# EAGLE design schema esp201 (EAGLE 6.5.0)
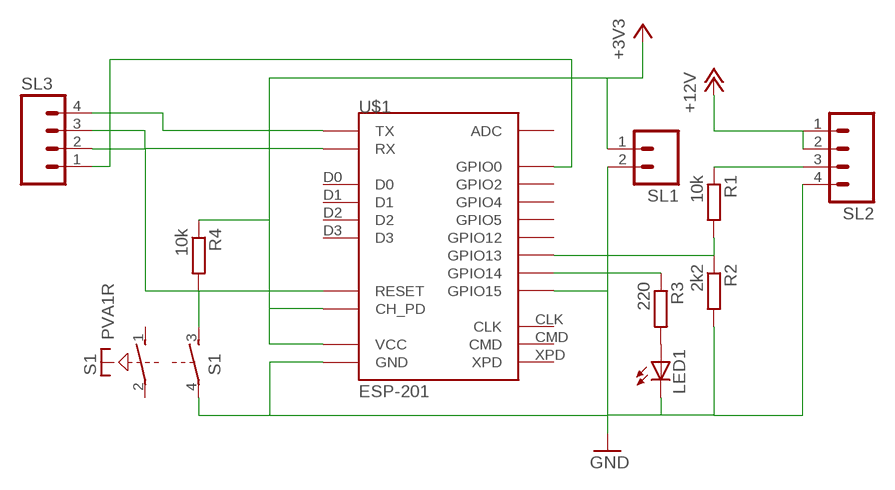
[diagram p0: schematic, sheet 1]

## Parts
LED1  LED3MM  [LED3MM]
R1  10k  R-EU_0207/10  [0207/10]
R2  2k2  R-EU_0207/10  [0207/10]
R3  220  R-EU_0207/10  [0207/10]
R4  10k  R-EU_0207/10  [0207/10]
S1  PVA1R  [PVA1R]
SL1  M02  [02P]
SL2  M04  [04P]
SL3  M04  [04P]
U$1  ESP-201  [ESP-201]

## Nets
+3V3: R4.1 SL1.1 U$1.3V3(VCC) U$1.3V3_2(VCC) U$1.3V3_3(VCC) U$1.CH_PD
+12V: SL2.1 SL2.2
GND: LED1.K(C) R2.2 S1.4(2:P) SL1.2 SL2.4 U$1.GND U$1.GND_2(GND) U$1.GND_3(GND) U$1.GPIO15
N$1: LED1.A R3.2
N$2: R1.2 R2.1 U$1.GPIO13
N$3: R3.1 U$1.GPIO14
N$4: R4.2 S1.3(2:S) SL3.2 U$1.RST(RESET)
N$5: SL3.4 U$1.TX
N$6: SL3.3 U$1.RX
N$7: R1.1 SL2.3
N$8: SL3.1 U$1.GPIO0
Unconnected: S1.1(1:S) S1.2(1:P) U$1.ADC U$1.CLK U$1.CMD U$1.D0 U$1.D1 U$1.D2 U$1.D3 U$1.GPIO2 U$1.GPIO4 U$1.GPIO5 U$1.GPIO12 U$1.XPD

## Library data of the parts
LED1 = led:LED: LED OSRAM: - CHIPLED LG R971, LG N971, LY N971, LG Q971, LY Q971, LO R971, LY R971 LH N974, LH R974 LS Q976, LO Q976, LY Q976 LO Q996 - Hyper CHIPLED LW Q18S LB Q993, LB Q99A, LB R99A - SideLED LS A670, LO A670, LY A670, LG A670, LP A670 LB A673, LV A673, LT A673, LW A673 LH A674 LY A675 LS A676, LA A676, LO A676, LY A676, LW A676 LS A679, LY A679, LG A679 - Hyper Micro SIDELED® LS Y876, LA Y876, LO Y876, LY Y876 LT Y87S - SmartLED LW L88C, LW L88S LB L89C, LB L89S, LG L890 LS L89K, LO L89K, LY L89K LS L896, LA L896, LO L896, LY L896 - TOPLED LS T670, LO T670, LY T670, LG T670, LP T670 LSG T670, LSP T670, LSY T670, LOP T670, LYG T670 LG T671, LOG T671, LSG T671 LB T673, LV T673, LT T673, LW T673 LH T674 LS T676, LA T676, LO T676, LY T676, LB T676, LH T676, LSB T676, LW T676 LB T67C, LV T67C, LT T67C, LS T67K, LO T67K, LY T67K, LW E67C LS E67B, LA E67B, LO E67B, LY E67B, LB E67C, LV E67C, LT E67C LW T67C LS T679, LY T679, LG T679 LS T770, LO T770, LY T770, LG T770, LP T770 LB T773, LV T773, LT T773, LW T773 LH T774 LS E675, LA E675, LY E675, LS T675 LS T776, LA T776, LO T776, LY T776, LB T776 LHGB T686 LT T68C, LB T68C - Hyper Mini TOPLED® LB M676 - Mini TOPLED Santana® LG M470 LS M47K, LO M47K, LY M47K Source: http://www.osram.convergy.de LUXEON: - LUMILED® LXK2-PW12-R00, LXK2-PW12-S00, LXK2-PW14-U00, LXK2-PW14-V00 LXK2-PM12-R00, LXK2-PM12-S00, LXK2-PM14-U00 LXK2-PE12-Q00, LXK2-PE12-R00, LXK2-PE12-S00, LXK2-PE14-T00, LXK2-PE14-U00 LXK2-PB12-K00, LXK2-PB12-L00, LXK2-PB12-M00, LXK2-PB14-N00, LXK2-PB14-P00, LXK2-PB14-Q00 LXK2-PR12-L00, LXK2-PR12-M00, LXK2-PR14-Q00, LXK2-PR14-R00 LXK2-PD12-Q00, LXK2-PD12-R00, LXK2-PD12-S00 LXK2-PH12-R00, LXK2-PH12-S00 LXK2-PL12-P00, LXK2-PL12-Q00, LXK2-PL12-R00 Source: www.luxeon.com KINGBRIGHT: KA-3528ASYC Source: www.kingbright.com
R1-R4 = rcl:R-EU_: RESISTOR, European symbol
S1 = switch-misc:PVA1R: ITT SWITCH
SL1 = con-amp-quick:M02: AMP QUICK CONNECTOR; OC_FARNELL: unknown; OC_NEWARK: unknown
SL2 SL3 = con-amp-quick:M04: AMP QUICK CONNECTOR; OC_FARNELL: unknown; OC_NEWARK: unknown
U$1 = esp8266modules:ESP-201: ESP8266 Wifi Module ESP-201; DIMENSIONS: 25 x 35 mm; PINS: 26; PITCH: 0.1" / 2.54 mm

## Board
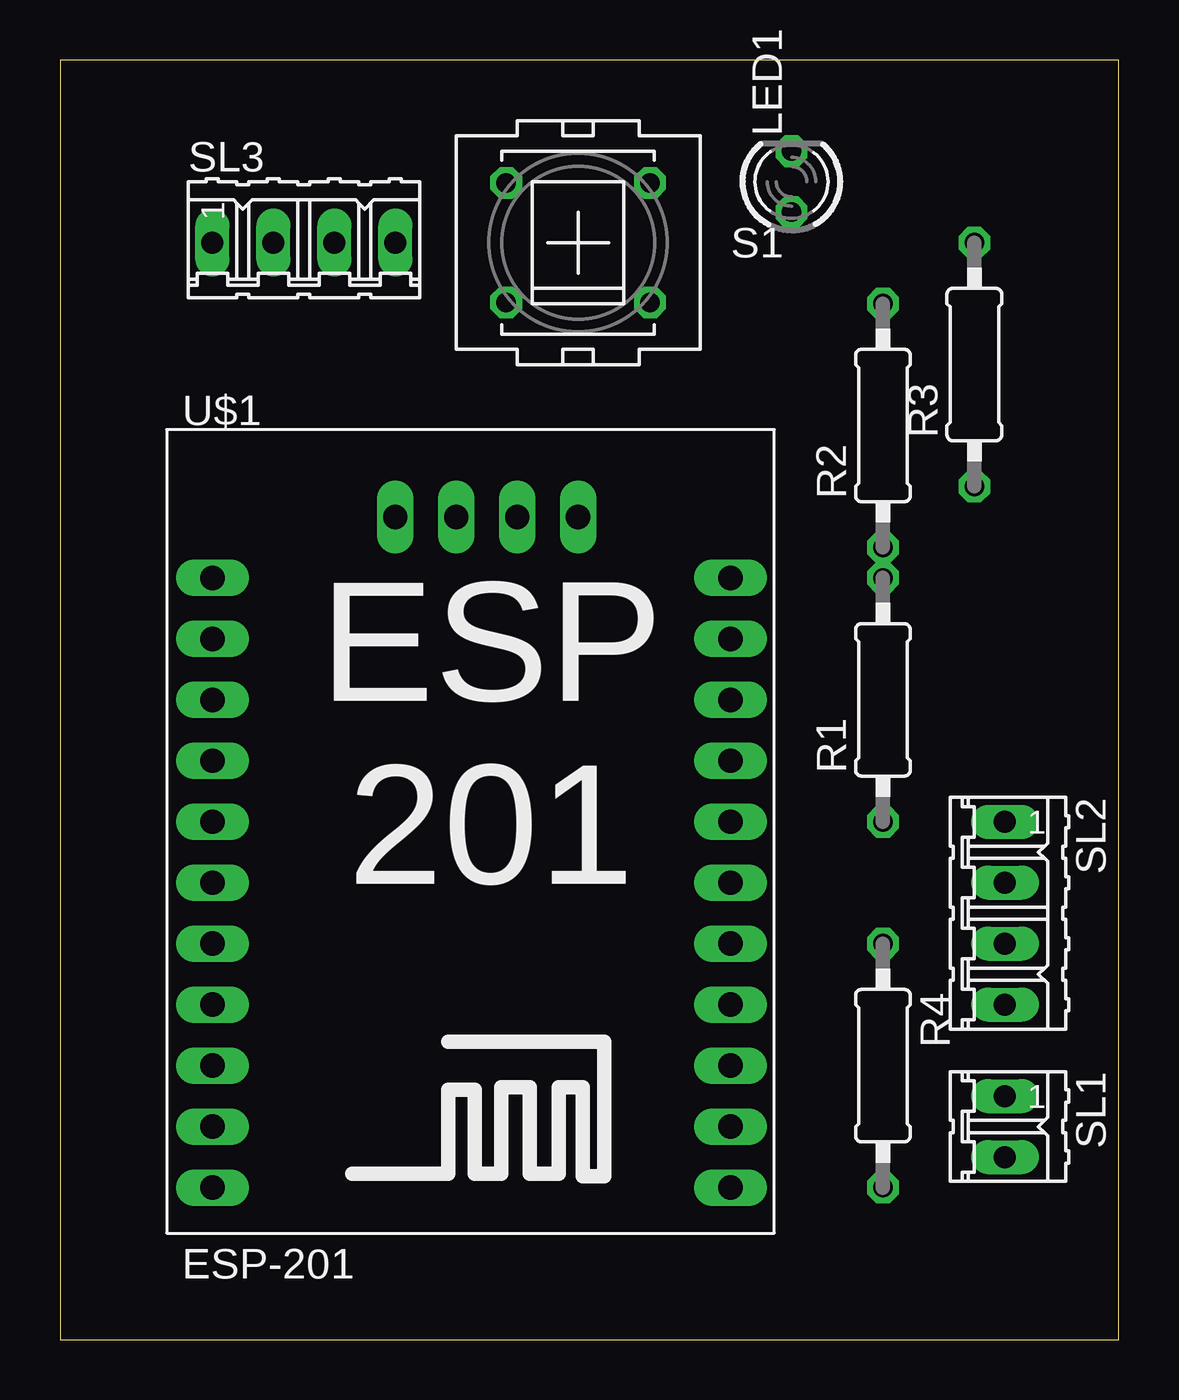
[diagram p1: board, top side]
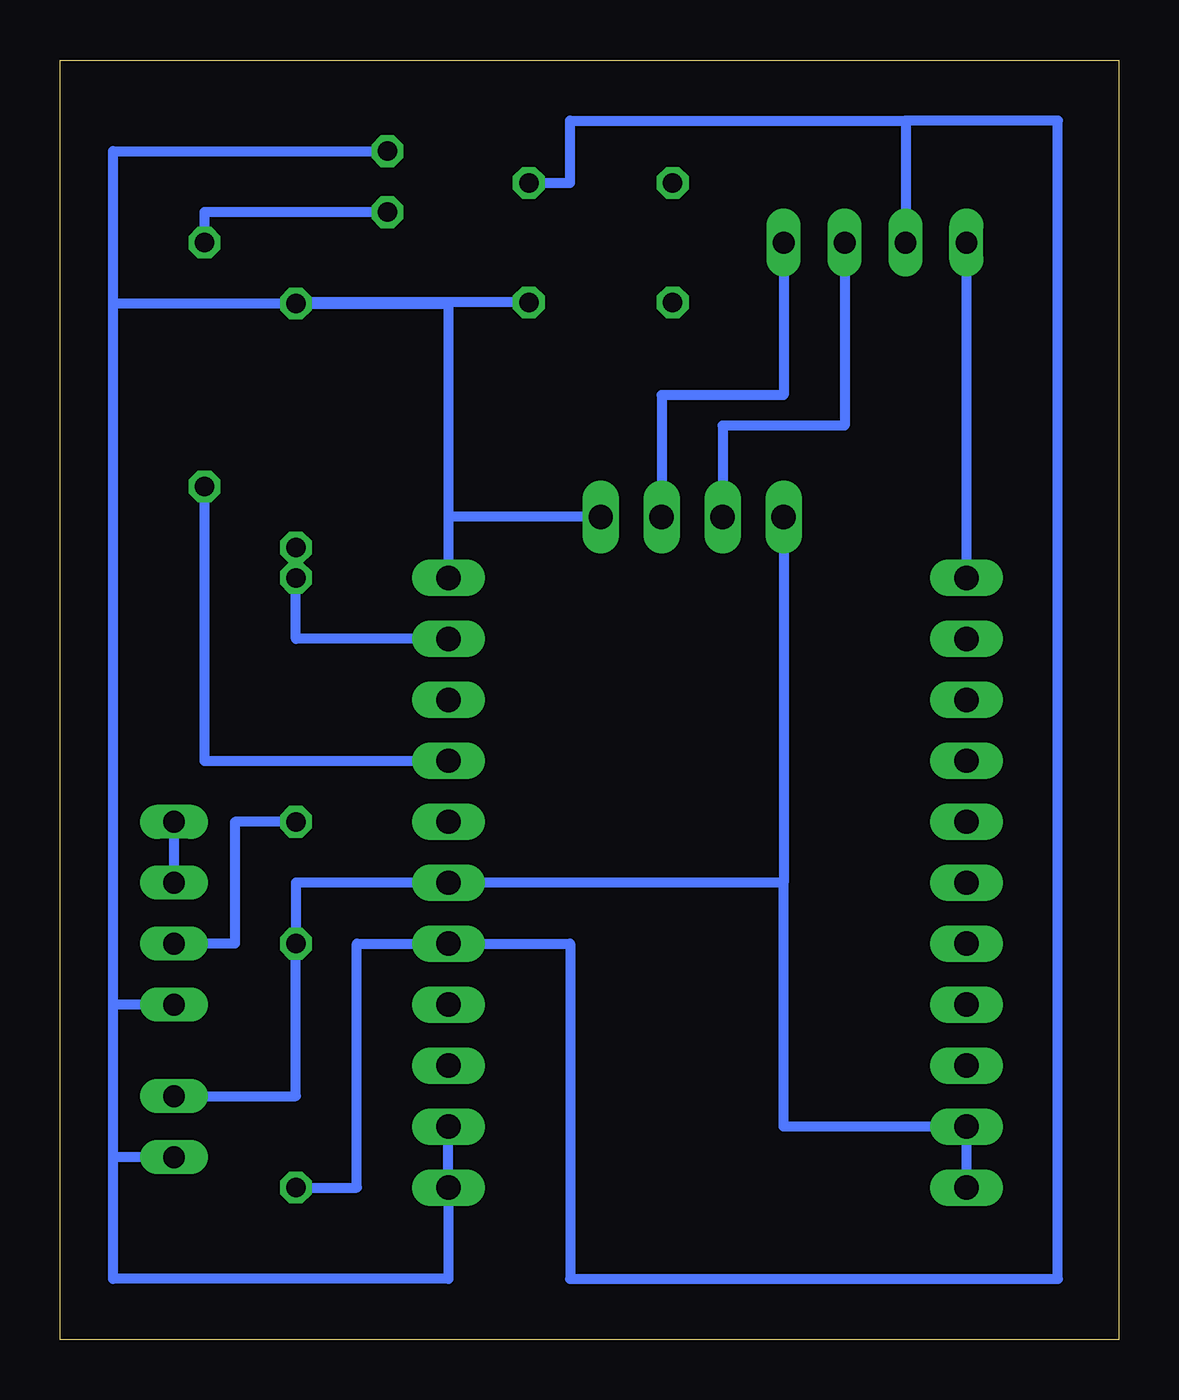
[diagram p2: board, bottom side, seen from below]

Size 44.12 x 53.33 mm. Coordinates in mm from the lower left corner, seen from the top.
Outline: 0,0 44.12,0 44.12,53.33 0,53.33 0,0
Copper layers (1*16): Top 0.035mm / dielectric 1.5mm / Bottom 0.035mm
Design rules "default": minimum track width 10mil, minimum drill 24mil, track to track 8mil, track to pad 8mil, pad to pad 8mil, via to via 8mil, smd to smd 8mil, copper to edge 40mil, drill to drill 8mil, minimum pad ring 10mil, minimum via ring 8mil, stop-mask expansion 4mil, vias tented up to drill 0mil, thermal gap 10mil

### Footprints (pad centres in the part's own frame; a part is rotated, then mirrored left to right if it is on the bottom)
LED3MM = drill 0.813 octagon: A -1.27,0; K 1.27,0
0207/10 = drill 0.813 octagon: 1 -5.08,0; 2 5.08,0
PVA1R = drill 0.813 octagon: 1 -2.997,2.489; 2 -2.997,-2.489; 3 2.997,2.489; 4 2.997,-2.489
02P = drill 0.914 long: 1 -1.27,0; 2 1.27,0
04P = drill 0.914 long: 1 -3.81,0; 2 -1.27,0; 3 1.27,0; 4 3.81,0
ESP-201 = drill 1.016 long: 3V3 0,2.54; 3V3_2 0,0; 3V3_3 7.62,27.94; ADC 21.59,7.62; CH_PD 21.59,12.7; CLK 0,17.78; CMD 0,15.24; D0 0,12.7; D1 0,10.16; D2 0,20.32; D3 0,7.62; GND 21.59,2.54; GND_2 21.59,0; GND_3 15.24,27.94; GPIO0 0,25.4; GPIO2 0,22.86; GPIO4 0,5.08; GPIO5 21.59,5.08; GPIO12 21.59,20.32; GPIO13 21.59,22.86; GPIO14 21.59,17.78; GPIO15 21.59,25.4; RST 21.59,10.16; RX 10.16,27.94; TX 12.7,27.94; XPD 21.59,15.24

### Placement (x,y rotation side)
LED1  30.48,48.26 90 top
R1  34.29,26.67 90 top
R2  34.29,38.1 90 top
R3  38.1,40.64 90 top
R4  34.29,11.43 270 top
S1  21.59,45.72 0 top
SL1  39.37,8.89 270 top
SL2  39.37,17.78 270 top
SL3  10.16,45.72 0 top
U$1  6.35,6.35 0 top

### Tracks (layer width: path | path; a pad name or v marks a point on that pad's centre or on a via)
+3V3
  Bottom 0.406: 13.97,19.05 13.97,8.89 U$1.3V3 U$1.3V3_2 | 13.97,19.05 U$1.CH_PD 34.29,19.05 R4.1 34.29,10.16 SL1.1 | U$1.3V3_3 13.97,19.05
+12V
  Bottom 0.406: SL2.2 SL2.1
GND
  Bottom 0.406: R2.2 41.91,43.18 | 41.91,43.18 41.91,49.53 LED1.K | U$1.GND_3 27.94,34.29 | 27.94,34.29 U$1.GPIO15 | 41.91,7.62 41.91,2.54 27.94,2.54 U$1.GND_2 U$1.GND | 41.91,7.62 41.91,13.97 | 41.91,13.97 41.91,43.18 | S1.4 34.29,43.23 R2.2 | R2.2 27.94,43.18 27.94,34.29 | SL1.2 41.91,7.62 | SL2.4 41.91,13.97
N$1
  Bottom 0.406: LED1.A 38.1,46.99 R3.2
N$2
  Bottom 0.406: U$1.GPIO13 34.29,29.21 R1.2 R2.1
N$3
  Bottom 0.406: R3.1 38.1,24.13 U$1.GPIO14
N$4
  Bottom 0.406: R4.2 31.75,6.35 31.75,16.51 U$1.RST 22.86,16.51 22.86,2.54 2.54,2.54 2.54,50.8 8.89,50.8 | 8.89,50.8 SL3.2 | S1.3 22.86,48.21 22.86,50.8 8.89,50.8
N$5
  Bottom 0.406: SL3.4 13.97,39.37 19.05,39.37 U$1.TX
N$6
  Bottom 0.406: SL3.3 11.43,38.1 16.51,38.1 U$1.RX
N$7
  Bottom 0.406: R1.1 36.83,21.59 36.83,16.51 SL2.3
N$8
  Bottom 0.406: SL3.1 U$1.GPIO0